# EAGLE design LED_Limiter (EAGLE 7.2.0)
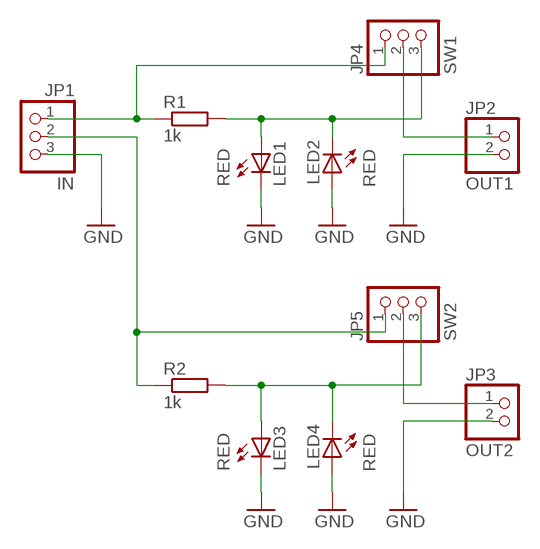
[diagram p0: schematic, sheet 1]

## Parts
JP1  IN  PINHD-1X3  [1X03]
JP2  OUT1  PINHD-1X2  [1X02]
JP3  OUT2  PINHD-1X2  [1X02]
JP4  SW1  PINHD-1X3  [1X03]
JP5  SW2  PINHD-1X3  [1X03]
LED1  RED  LED3MM  [LED3MM]
LED2  RED  LED3MM  [LED3MM]
LED3  RED  LED3MM  [LED3MM]
LED4  RED  LED3MM  [LED3MM]
R1  1k  R-EU_0207/7  [0207/7]
R2  1k  R-EU_0207/7  [0207/7]

## Nets
GND: JP1.3 JP2.2 JP3.2 LED1.K(C) LED2.A LED3.K(C) LED4.A
IN: JP1.1 JP4.1 R1.1
N$1: JP2.1 JP4.2
N$3: JP4.3 LED1.A LED2.K(C) R1.2
N$4: JP5.3 LED3.A LED4.K(C) R2.2
N$5: JP3.1 JP5.2
N$6: JP1.2 JP5.1 R2.1

## Library data of the parts
JP1 JP4 JP5 = pinhead:PINHD-1X3: PIN HEADER
JP2 JP3 = pinhead:PINHD-1X2: PIN HEADER
LED1-LED4 = led:LED: LED OSRAM: - CHIPLED LG R971, LG N971, LY N971, LG Q971, LY Q971, LO R971, LY R971 LH N974, LH R974 LS Q976, LO Q976, LY Q976 LO Q996 - Hyper CHIPLED LW Q18S LB Q993, LB Q99A, LB R99A - SideLED LS A670, LO A670, LY A670, LG A670, LP A670 LB A673, LV A673, LT A673, LW A673 LH A674 LY A675 LS A676, LA A676, LO A676, LY A676, LW A676 LS A679, LY A679, LG A679 - Hyper Micro SIDELED® LS Y876, LA Y876, LO Y876, LY Y876 LT Y87S - SmartLED LW L88C, LW L88S LB L89C, LB L89S, LG L890 LS L89K, LO L89K, LY L89K LS L896, LA L896, LO L896, LY L896 - TOPLED LS T670, LO T670, LY T670, LG T670, LP T670 LSG T670, LSP T670, LSY T670, LOP T670, LYG T670 LG T671, LOG T671, LSG T671 LB T673, LV T673, LT T673, LW T673 LH T674 LS T676, LA T676, LO T676, LY T676, LB T676, LH T676, LSB T676, LW T676 LB T67C, LV T67C, LT T67C, LS T67K, LO T67K, LY T67K, LW E67C LS E67B, LA E67B, LO E67B, LY E67B, LB E67C, LV E67C, LT E67C LW T67C LS T679, LY T679, LG T679 LS T770, LO T770, LY T770, LG T770, LP T770 LB T773, LV T773, LT T773, LW T773 LH T774 LS E675, LA E675, LY E675, LS T675 LS T776, LA T776, LO T776, LY T776, LB T776 LHGB T686 LT T68C, LB T68C - Hyper Mini TOPLED® LB M676 - Mini TOPLED Santana® LG M470 LS M47K, LO M47K, LY M47K Source: http://www.osram.convergy.de LUXEON: - LUMILED® LXK2-PW12-R00, LXK2-PW12-S00, LXK2-PW14-U00, LXK2-PW14-V00 LXK2-PM12-R00, LXK2-PM12-S00, LXK2-PM14-U00 LXK2-PE12-Q00, LXK2-PE12-R00, LXK2-PE12-S00, LXK2-PE14-T00, LXK2-PE14-U00 LXK2-PB12-K00, LXK2-PB12-L00, LXK2-PB12-M00, LXK2-PB14-N00, LXK2-PB14-P00, LXK2-PB14-Q00 LXK2-PR12-L00, LXK2-PR12-M00, LXK2-PR14-Q00, LXK2-PR14-R00 LXK2-PD12-Q00, LXK2-PD12-R00, LXK2-PD12-S00 LXK2-PH12-R00, LXK2-PH12-S00 LXK2-PL12-P00, LXK2-PL12-Q00, LXK2-PL12-R00 Source: www.luxeon.com KINGBRIGHT: KA-3528ASYC Source: www.kingbright.com
R1 R2 = rcl:R-EU_: RESISTOR, European symbol

## Board
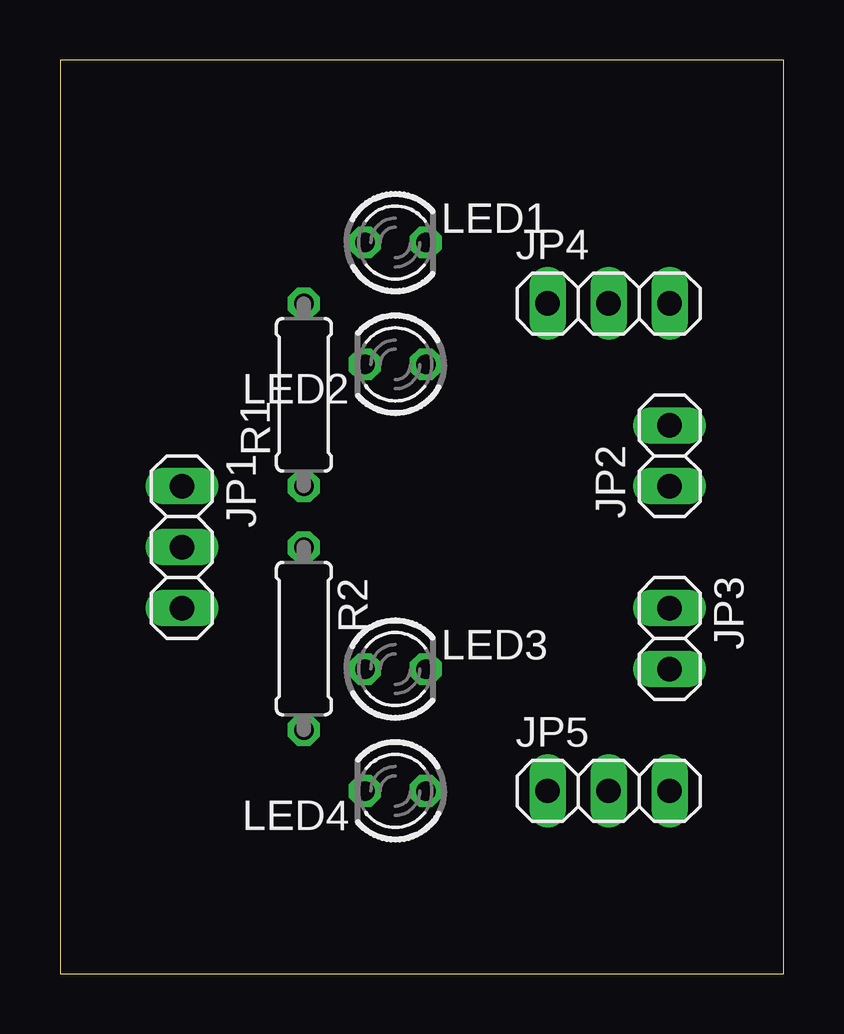
[diagram p1: board, top side]
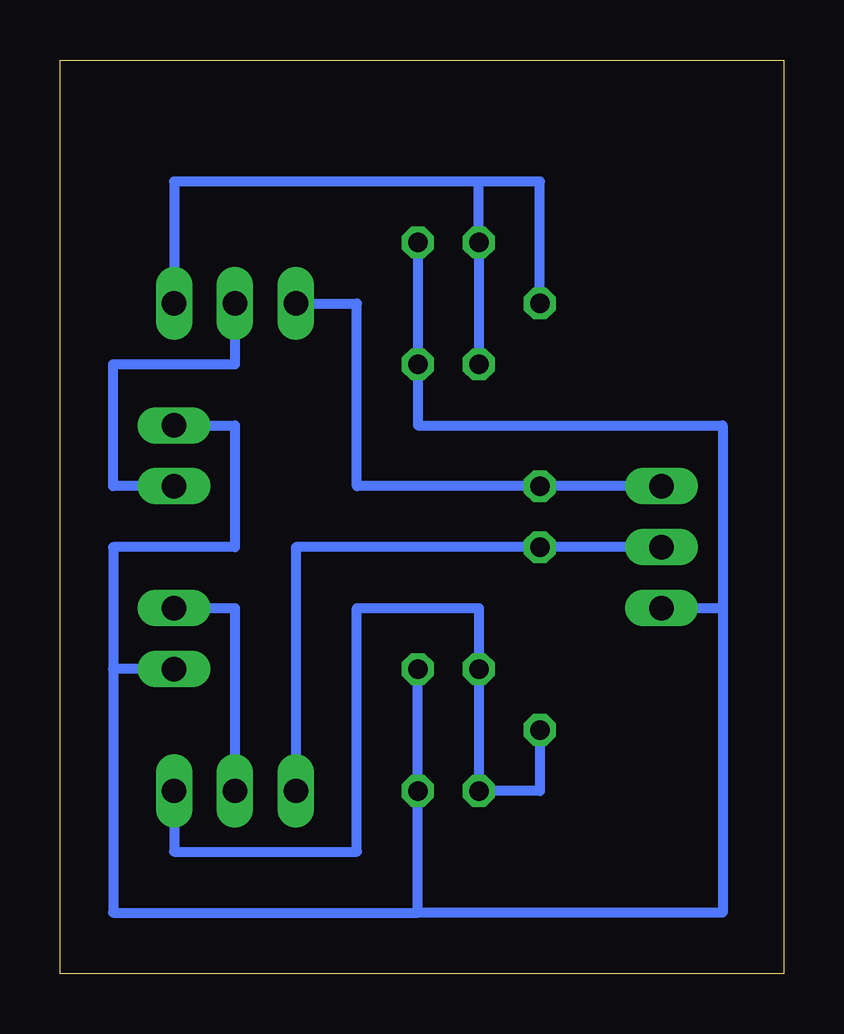
[diagram p2: board, bottom side, seen from below]

Size 30.15 x 38.09 mm. Coordinates in mm from the lower left corner, seen from the top.
Outline: 0,0 30.15,0 30.15,38.09 0,38.09 0,0
Copper layers (1*16): Top 0.035mm / dielectric 1.5mm / Bottom 0.035mm
Design rules "default": minimum track width 10mil, minimum drill 24mil, track to track 8mil, track to pad 8mil, pad to pad 8mil, via to via 8mil, smd to smd 8mil, copper to edge 40mil, drill to drill 8mil, minimum pad ring 10mil, minimum via ring 8mil, stop-mask expansion 4mil, vias tented up to drill 0mil, thermal gap 10mil

### Footprints (pad centres in the part's own frame; a part is rotated, then mirrored left to right if it is on the bottom)
1X03 = drill 1.016 long: 1 -2.54,0; 2 0,0; 3 2.54,0
1X02 = drill 1.016 long: 1 -1.27,0; 2 1.27,0
LED3MM = drill 0.813 octagon: A -1.27,0; K 1.27,0
0207/7 = drill 0.813 octagon: 1 -3.81,0; 2 3.81,0

### Placement (x,y rotation side)
JP1  5.08,17.78 270 top
JP2  25.4,21.59 90 top
JP3  25.4,13.97 270 top
JP4  22.86,27.94 0 top
JP5  22.86,7.62 0 top
LED1  13.97,30.48 0 top
LED2  13.97,25.4 180 top
LED3  13.97,12.7 0 top
LED4  13.97,7.62 180 top
R1  10.16,24.13 90 top
R2  10.16,13.97 270 top

### Tracks (layer width: path | path; a pad name or v marks a point on that pad's centre or on a via)
GND
  Bottom 0.406: 15.24,2.54 2.54,2.54 2.54,15.24 | 15.24,2.54 LED4.A LED3.K | 27.94,12.7 27.94,2.54 15.24,2.54 | LED1.K LED2.A 15.24,22.86 2.54,22.86 2.54,15.24 | 27.94,12.7 27.94,17.78 22.86,17.78 22.86,22.86 JP2.2 | JP1.3 2.54,15.24 | JP3.2 27.94,12.7
IN
  Bottom 0.406: JP1.1 R1.1 17.78,20.32 17.78,27.94 JP4.1
N$1
  Bottom 0.406: JP2.1 27.94,20.32 27.94,25.4 22.86,25.4 JP4.2
N$3
  Bottom 0.406: LED2.K LED1.A 12.7,33.02 | 12.7,33.02 25.4,33.02 JP4.3 | R1.2 10.16,33.02 12.7,33.02
N$4
  Bottom 0.406: R2.2 10.16,7.62 LED4.K LED3.A 12.7,15.24 17.78,15.24 17.78,5.08 25.4,5.08 JP5.3
N$5
  Bottom 0.406: JP3.1 22.86,15.24 JP5.2
N$6
  Bottom 0.406: JP1.2 R2.1 20.32,17.78 JP5.1